# EAGLE design Breadboard Power Supply (EAGLE 7.1.0)
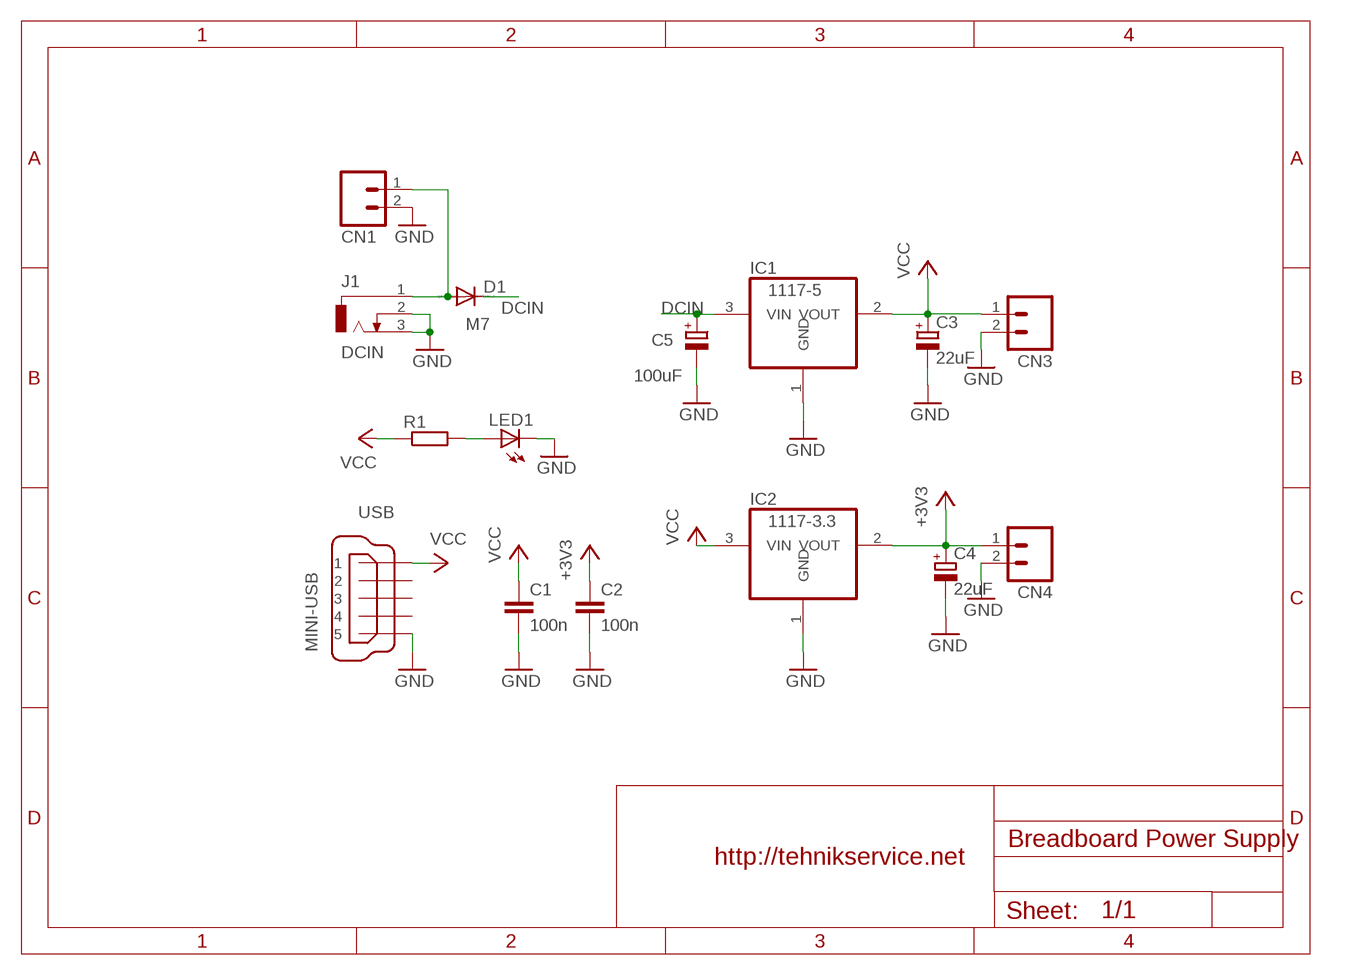
[diagram p0: schematic, sheet 1]

## Parts
C1  100n  C-EUC0805  [C0805]
C2  100n  C-EUC0805  [C0805]
C3  22uF  CPOL-EUE2.5-5  [E2,5-5]
C4  22uF  CPOL-EUE2.5-5  [E2,5-5]
C5  100uF  CPOL-EUE2.5-5  [E2,5-5]
CN1  M02  [02P]
CN3  M02  [02P]
CN4  M02  [02P]
D1  M7  DIODE-DO-214AC  [DO-214AC]
IC1  1117-5  REG1117  [SOT223]
IC2  1117-3.3  REG1117  [SOT223]
J1  DCIN  DCJ0202  [DCJ0202]
LED1  LEDCHIPLED_0805  [CHIPLED_0805]
R1  R-EU_R0805  [R0805]
USB  MINI-USB  MINI-USB-32005-201  [32005-201]

## Nets
+3V3: C2.1 C4.+ CN4.1 IC2.2(VOUT)
DCIN: C5.+ D1.C IC1.3(VIN)
GND: C1.2 C2.2 C3.- C4.- C5.- CN1.2 CN3.2 CN4.2 IC1.1(GND) IC2.1(GND) J1.2 J1.3 LED1.C USB.5
N$1: LED1.A R1.2
N$2: CN1.1 D1.A J1.1
VCC: C1.1 C3.+ CN3.1 IC1.2(VOUT) IC2.3(VIN) R1.1 USB.1
Unconnected: USB.2 USB.3 USB.4

## Notes on the sheet
- http://tehnikservice.net

## Library data of the parts
C1 C2 = rcl:C-EU: CAPACITOR, European symbol
C3-C5 = rcl:CPOL-EU: POLARIZED CAPACITOR, European symbol
CN1 CN3 CN4 = con-amp-quick:M02: AMP QUICK CONNECTOR; OC_FARNELL: unknown; OC_NEWARK: unknown
D1 = diode:DIODE-: DIODE
IC1 IC2 = burr-brown:REG1117: 800mA and 1A Low Dropout (LDO) Positive Regulator 1.8V, 2.5V, 2.85V, 3.3V, 5V, and Adj; MPN: REG1117; OC_FARNELL: 1097566; OC_NEWARK: 14P6981
J1 = con-jack:DCJ0202: DC POWER JACK Source: DCJ0202.pdf; OC_FARNELL: unknown; OC_NEWARK: unknown
LED1 = led:LED: LED OSRAM: - CHIPLED LG R971, LG N971, LY N971, LG Q971, LY Q971, LO R971, LY R971 LH N974, LH R974 LS Q976, LO Q976, LY Q976 LO Q996 - Hyper CHIPLED LW Q18S LB Q993, LB Q99A, LB R99A - SideLED LS A670, LO A670, LY A670, LG A670, LP A670 LB A673, LV A673, LT A673, LW A673 LH A674 LY A675 LS A676, LA A676, LO A676, LY A676, LW A676 LS A679, LY A679, LG A679 - Hyper Micro SIDELED® LS Y876, LA Y876, LO Y876, LY Y876 LT Y87S - SmartLED LW L88C, LW L88S LB L89C, LB L89S, LG L890 LS L89K, LO L89K, LY L89K LS L896, LA L896, LO L896, LY L896 - TOPLED LS T670, LO T670, LY T670, LG T670, LP T670 LSG T670, LSP T670, LSY T670, LOP T670, LYG T670 LG T671, LOG T671, LSG T671 LB T673, LV T673, LT T673, LW T673 LH T674 LS T676, LA T676, LO T676, LY T676, LB T676, LH T676, LSB T676, LW T676 LB T67C, LV T67C, LT T67C, LS T67K, LO T67K, LY T67K, LW E67C LS E67B, LA E67B, LO E67B, LY E67B, LB E67C, LV E67C, LT E67C LW T67C LS T679, LY T679, LG T679 LS T770, LO T770, LY T770, LG T770, LP T770 LB T773, LV T773, LT T773, LW T773 LH T774 LS E675, LA E675, LY E675, LS T675 LS T776, LA T776, LO T776, LY T776, LB T776 LHGB T686 LT T68C, LB T68C - Hyper Mini TOPLED® LB M676 - Mini TOPLED Santana® LG M470 LS M47K, LO M47K, LY M47K Source: http://www.osram.convergy.de LUXEON: - LUMILED® LXK2-PW12-R00, LXK2-PW12-S00, LXK2-PW14-U00, LXK2-PW14-V00 LXK2-PM12-R00, LXK2-PM12-S00, LXK2-PM14-U00 LXK2-PE12-Q00, LXK2-PE12-R00, LXK2-PE12-S00, LXK2-PE14-T00, LXK2-PE14-U00 LXK2-PB12-K00, LXK2-PB12-L00, LXK2-PB12-M00, LXK2-PB14-N00, LXK2-PB14-P00, LXK2-PB14-Q00 LXK2-PR12-L00, LXK2-PR12-M00, LXK2-PR14-Q00, LXK2-PR14-R00 LXK2-PD12-Q00, LXK2-PD12-R00, LXK2-PD12-S00 LXK2-PH12-R00, LXK2-PH12-S00 LXK2-PL12-P00, LXK2-PL12-Q00, LXK2-PL12-R00 Source: www.luxeon.com KINGBRIGHT: KA-3528ASYC Source: www.kingbright.com
R1 = rcl:R-EU_: RESISTOR, European symbol
USB = con-cypressindustries:MINI-USB-: MINI USB-B Conector Source: www.cypressindustries.com; OC_FARNELL: unknown; OC_NEWARK: unknown

## Board
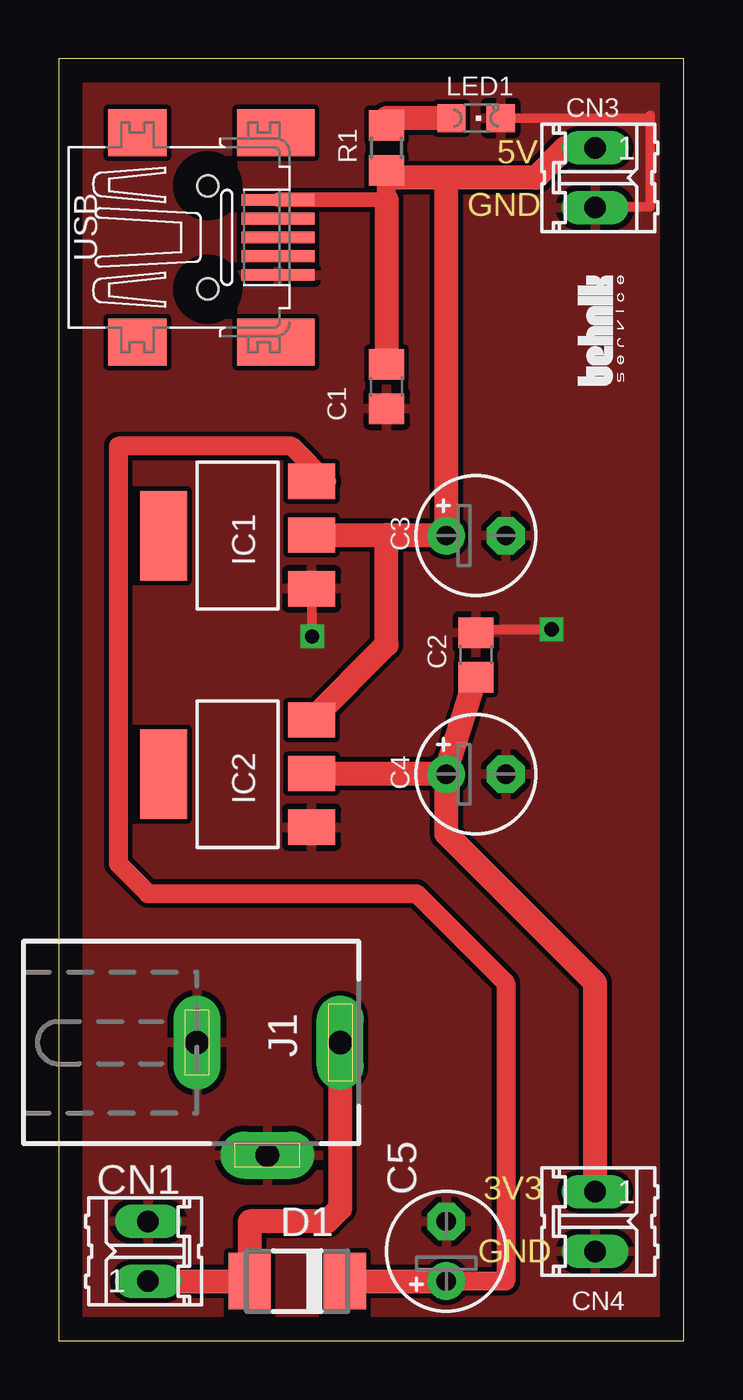
[diagram p1: board, top side]
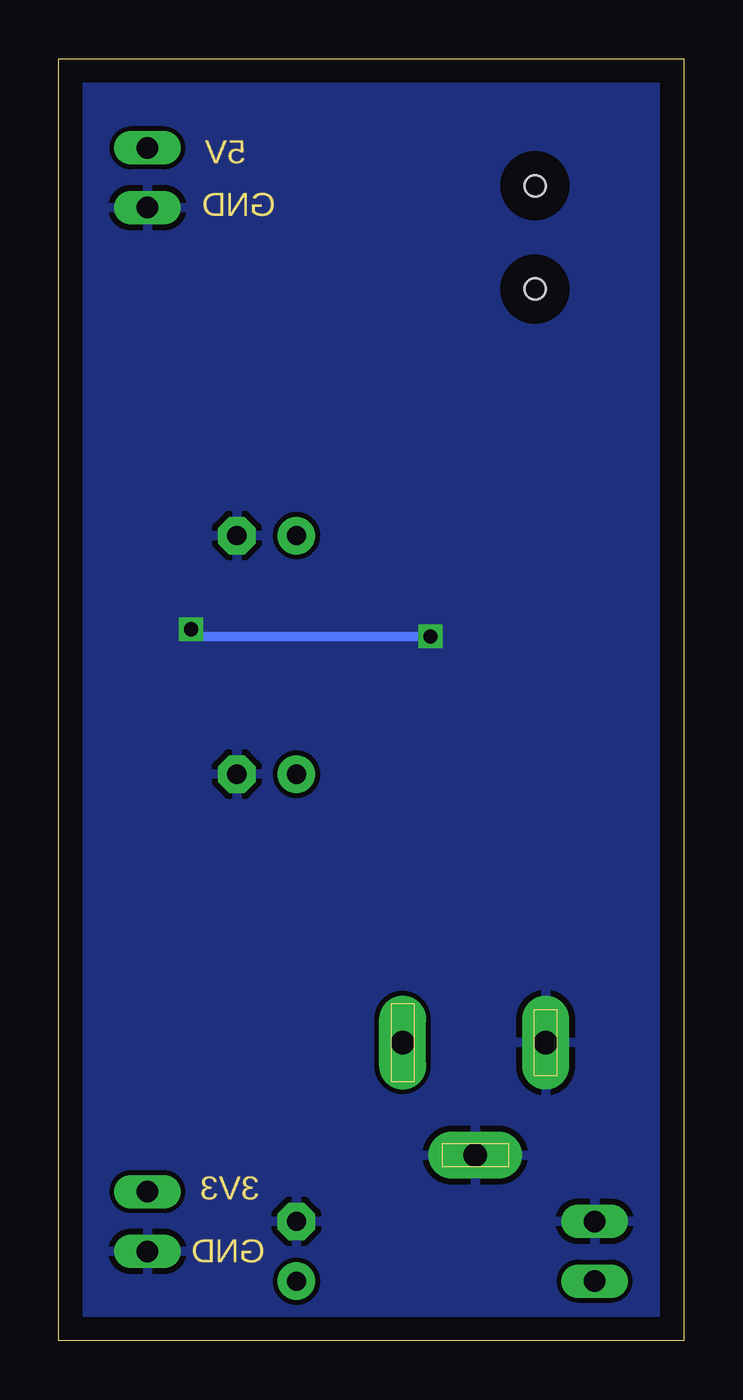
[diagram p2: board, bottom side, seen from below]

Size 26.64 x 54.6 mm. Coordinates in mm from the lower left corner, seen from the top.
Outline: 0,0 26.64,0 26.64,54.6 0,54.6 0,0
Copper layers (1*16): Top 0.035mm / dielectric 1.5mm / Bottom 0.035mm
Design rules "default": minimum track width 10mil, minimum drill 24mil, track to track 8mil, track to pad 8mil, pad to pad 8mil, via to via 8mil, smd to smd 8mil, copper to edge 40mil, drill to drill 8mil, minimum pad ring 10mil, minimum via ring 8mil, stop-mask expansion 4mil, vias tented up to drill 0mil, thermal gap 10mil

### Footprints (pad centres in the part's own frame; a part is rotated, then mirrored left to right if it is on the bottom)
C0805 = smd 1.3 x 1.5: 1 -0.95,0; 2 0.95,0
E2,5-5 = drill 0.813 pad 1.6: + -1.27,0 | drill 0.813 pad 1.6 octagon: - 1.27,0
02P = drill 0.914 long: 1 -1.27,0; 2 1.27,0
DO-214AC = smd 1.8 x 2.4: A 2.025,0; C -2.025,0
SOT223 = smd 1.499 x 2.007: 1 -2.261,-3.15; 2 0.025,-3.15; 3 2.311,-3.15 | smd 3.81 x 2.007: 4 0,3.15
DCJ0202 = drill 1 pad 2 long: 1 0,3.1; 2 4.8,0; 3 0,-3
CHIPLED_0805 = smd 1.2 x 1.2: A 0,-1.05; C 0,1.05
R0805 = smd 1.3 x 1.5: 1 -0.95,0; 2 0.95,0
32005-201 = smd 3.1 x 0.5: 1 3,1.6; 2 3,0.8; 3 3,0; 4 3,-0.8; 5 3,-1.6 | smd 2.5 x 2: M1 -3,-4.45; M2 -3,4.45 | smd 3.3 x 2: M3 2.9,4.45; M4 2.9,-4.45 | hole 0.9: 0,2.2; 0,-2.2

### Placement (x,y rotation side)
C1  13.97,40.64 270 top
C2  17.78,29.21 90 top
C3  17.78,34.29 0 top
C4  17.78,24.13 0 top
C5  16.51,3.81 90 top
CN1  3.81,3.81 90 top
CN3  22.86,49.53 270 top
CN4  22.86,5.08 270 top
D1  10.16,2.54 180 top
IC1  7.62,34.29 90 top
IC2  7.62,24.13 90 top
J1  8.89,12.7 270 top
LED1  17.78,52.07 270 top
R1  13.97,50.8 90 top
U$1  [LOGOT]  24.13,40.64 90 top
USB  6.35,46.99 0 top

### Tracks (layer width: path | path; a pad name or v marks a point on that pad's centre or on a via)
+3V3
  Top 1.016: IC2.2 16.48,24.16 | 16.48,24.16 C4.+ 16.51,21.59 22.86,15.24 CN4.1 | 16.48,24.16 C2.1
DCIN
  Top 0.813: IC1.3 11.43,36.6 9.93,38.1 2.54,38.1 2.54,20.32 3.81,19.05 15.24,19.05 19.05,15.24 19.05,2.54 C5.+
  Top 1.016: D1.C C5.+
GND  (via drill 0.6)
  Top 0.406: IC1.1 10.8,32.03 v10.8,30 | v21,30.3 17.78,30.3 C2.2 | LED1.C 25.2,52.07 | 25.2,52.07 25.2,52.2 | 25.2,52.07 25.2,48.3 22.86,48.3 CN3.2
  Bottom 0.406: v10.8,30 21,30 v21,30.3
  pour Top: 0,54.61 26.67,54.61 26.67,0 0,0
  pour Bottom: 0,54.6 26.7,54.6 26.7,0 0,0
N$1
  Top 1.016: LED1.A 13.97,52.07 R1.2
N$2
  Top 1.016: CN1.1 D1.A 8.13,5.08 11.43,5.08 11.99,5.64 J1.1
VCC
  Top 0.61: USB.1 13.97,48.59
  Top 0.813: 13.97,48.59 R1.1
  Top 1.016: 13.97,48.59 C1.1 | CN3.1 21.59,50.8 20.32,49.53 16.51,49.53 | 16.51,49.53 14.29,49.53 R1.1 | IC1.2 13.97,34.31 | 13.97,34.31 16.48,34.31 | 16.48,34.31 C3.+ | 16.48,34.31 16.51,34.31 16.51,49.53 | IC2.3 13.97,29.64 13.97,34.31

### Text on the board
Dimension: 5V | GND | 3V3 | GND